# Altium schematic sheet DCPowerSupplies Design.SchDoc
size A; SheetNumber: 8; SheetTotal: 10
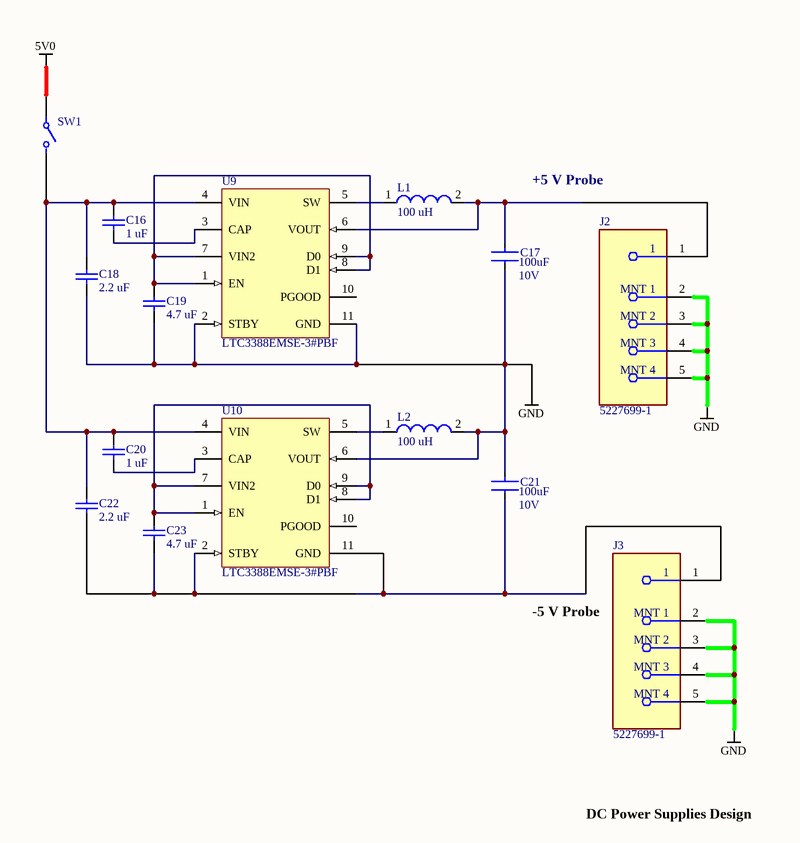
[diagram p0: DCPowerSupplies Design.SchDoc]

## Parts
C16  1 uF  [CAPC0603X33X15NL03T05]
C17  Voltage Rating (DC): 10V  Capacitance: 100uF  [FP-C5750-280-0_4-MFG]  (hidden comment: C5750X5R1A107M280KC)
C18  2.2 uF  [CAPC1608X90X35LL15T15]
C19  4.7 uF  [CAPC2013X140X50ML20T25]
C20  1 uF  [CAPC0603X33X15NL03T05]
C21  Voltage Rating (DC): 10V  Capacitance: 100uF  [FP-C5750-280-0_4-MFG]  (hidden comment: C5750X5R1A107M280KC)
C22  2.2 uF  [CAPC1608X90X35LL15T15]
C23  4.7 uF  [CAPC2013X140X50ML20T25]
J2  5227699-1  [FP-5227699-1-MFG]
J3  5227699-1  [FP-5227699-1-MFG]
L1  100 uH  [WE-PD3-L]
L2  100 uH  [WE-PD3-L]
SW1  A8L-11-12N1  [FP-A8L-11-12N1-MFG]  (value not drawn)
U9  LTC3388EMSE-3#PBF  [LT-MSE-10-EDP_L]
U10  LTC3388EMSE-3#PBF  [LT-MSE-10-EDP_L]

## Nets
5V0: SW1.1
GND: C17.2 C18.1 C19.1 C21.1 J2.2(MNT_1) J2.3(MNT_2) J2.4(MNT_3) J2.5(MNT_4) J3.2(MNT_1) J3.3(MNT_2) J3.4(MNT_3) J3.5(MNT_4) L2.2 U9.2(STBY) U9.11(GND) U10.6(VOUT)
NetC16_1: C16.1 U9.3(CAP)
NetC16_2: C16.2 C18.2 C20.2 C22.2 SW1.2 U9.4(VIN) U10.4(VIN)
NetC17_1: C17.1 J2.1 L1.2 U9.6(VOUT)
NetC19_2: C19.2 U9.1(EN) U9.7(VIN2) U9.8(D1) U9.9(D0)
NetC20_1: C20.1 U10.3(CAP)
NetC21_2: C21.2 C22.1 C23.1 J3.1 U10.2(STBY) U10.11(GND)
NetC23_2: C23.2 U10.1(EN) U10.7(VIN2) U10.8(D1) U10.9(D0)
NetL1_1: L1.1 U9.5(SW)
NetL2_1: L2.1 U10.5(SW)

Not connected (* = marked no-connect by the designer): U9 10(PGOOD); U10 10(PGOOD)

## Notes on the sheet
- +5 V Probe
- -5 V Probe
- DC Power Supplies Design

## Library data of the parts
C16 C20 = CMP-2010-00161-1: Part Number: 02016D105MAT2A; Manufacturer: AVX Interconnect / Elco
C17 C21 = CMP-08246-002645-1: CAP CER 100UF 10V X5R 2220; Dielectric Material: Ceramic; Tolerance: 20%; Number of Pins: 2; Construction: Flat; Series: C; Depth: 5mm; Voltage Rating: 10V; Dielectric: X5R; Mount: Surface Mount; Width: 5mm; Radiation Hardening: No; RoHS Compliant: Yes; Package Quantity: 1; Resistor Type: Ceramic; Lead Free: Lead Free; Min Operating Temperature: -55°C; Max Operating Temperature: 85°C; Length: 5.7mm; Weight: 0.016932oz; Case/Package: 2220; Thickness: 0.122inch; Termination: SMD/SMT; Case Code (Imperial): 2220; Case Code (Metric): 5750; Height: 2.3mm; Packaging: Tape and Reel
C18 C22 = CMP-2006-04563-1: Manufacturer: AVX Interconnect / Elco; Part Number: 0603ZD225KAT2A
C19 C23 = CMP-1036-04881-2: Part Number: 0805ZD475KAT2A; Manufacturer: AVX Interconnect / Elco
J2 J3 = CMP-03357-000003-1: CONN BNC JACK STR 50 OHM PCB; Frequency: 4GHz; Number of Positions: 1; Body Plating: Nickel; Gender: Female; PCB Mount Retention: Without; Polarity: Standard; Body Material: Zinc; Voltage Rating: 500V; Sealable: No (Without); PCB Mounting Orientation: Vertical; Impedance: 50R; Insulation Resistance: 5GR; Orientation: Straight; Package Quantity: 30; ELV: Compliant; Min Operating Temperature: -55°C; Length: 17.45mm; Termination: Solder; Connector Type: BNC; Fastening Type: Bayonet; Contact Plating: Silver; Depth: 17.45mm; Contact Material: Bronze; Max Frequency: 4GHz; Max Operating Temperature: 85°C; Radiation Hardening: No; Mount: Through Hole; Lead Free: Lead Free; Packaging: Rail/Tube
L1 L2 = CMP-0227-00779-1: SMD Shielded Power Inductor WE-PD3, L = 100 µH; Inductance: 100 ÂµH; ComponentLink2URL: http://www.we-online.de/katalog/media/pdf/7445420.pdf; ComponentLink1Description: Manufacturer Link; DatasheetVersion: ver 2, Sep-2006; PackageVersion: 2006; ComponentLink2Description: Datasheet; ComponentLink1URL: http://www.we-online.com; PackageReference: WE-PD3-L; PackageDescription: SMD Inductor, 2-Leads, Body 12.7 x 10.0 mm
SW1 = CMP-08830-000001-1: SWITCH ROCKER SPST 10A 125V; Max Voltage Rating (AC): 250V; Mechanical Life: 50000Cycles; Switch Function: On-Off; Electrical Life: 10000Cycles; Packaging: Bulk; Mount: Panel; Termination: PC Pins; Orientation: Straight; Max Operating Temperature: 55°C; Current Rating: 10A; RoHS Compliant: Yes; Throw Configuration: SPST; Min Operating Temperature: -20°C; Radiation Hardening: No; Voltage Rating (AC): 125V
U9 U10 = CMP-0473-00131-1: 20 V High Efficiency Nanopower Step-Down Regulator, 10-pin SOP (MSE-10), -40 to 125 degC, Pb-Free; Manufacturer: Linear Technology; Vout Max(V): 5.18; Vin Min(V): 2.7; Number of Outputs: 1; Topology: Buck; Vin Max(V): 20; ComponentLink1Description: Manufacturer URL; RoHS: TRUE; PackageVersion: Rev. I, 05/2013; ComponentLink2Description: Datasheet; PackageDescription: 10-Pin Plastic MSOP, Exposed Die Pad, Body 3 x 3 mm, Pitch 0.5 mm; Mounting Technology: Surface Mount; ComponentLink2URL: http://cds.linear.com/docs/en/datasheet/338813f.pdf; PartNumber: LTC3388EMSE-3#PBF; PackageReference: MSE-10; ComponentLink3URL: http://cds.linear.com/docs/en/packaging/05081664_I_MSE.pdf; ComponentLink3Description: Package Specification; ComponentLink1URL: http://www.linear.com/